# Altium schematic sheet Sheet2.SchDoc: SMART METER Main Board
size A3; SheetNumber: 2
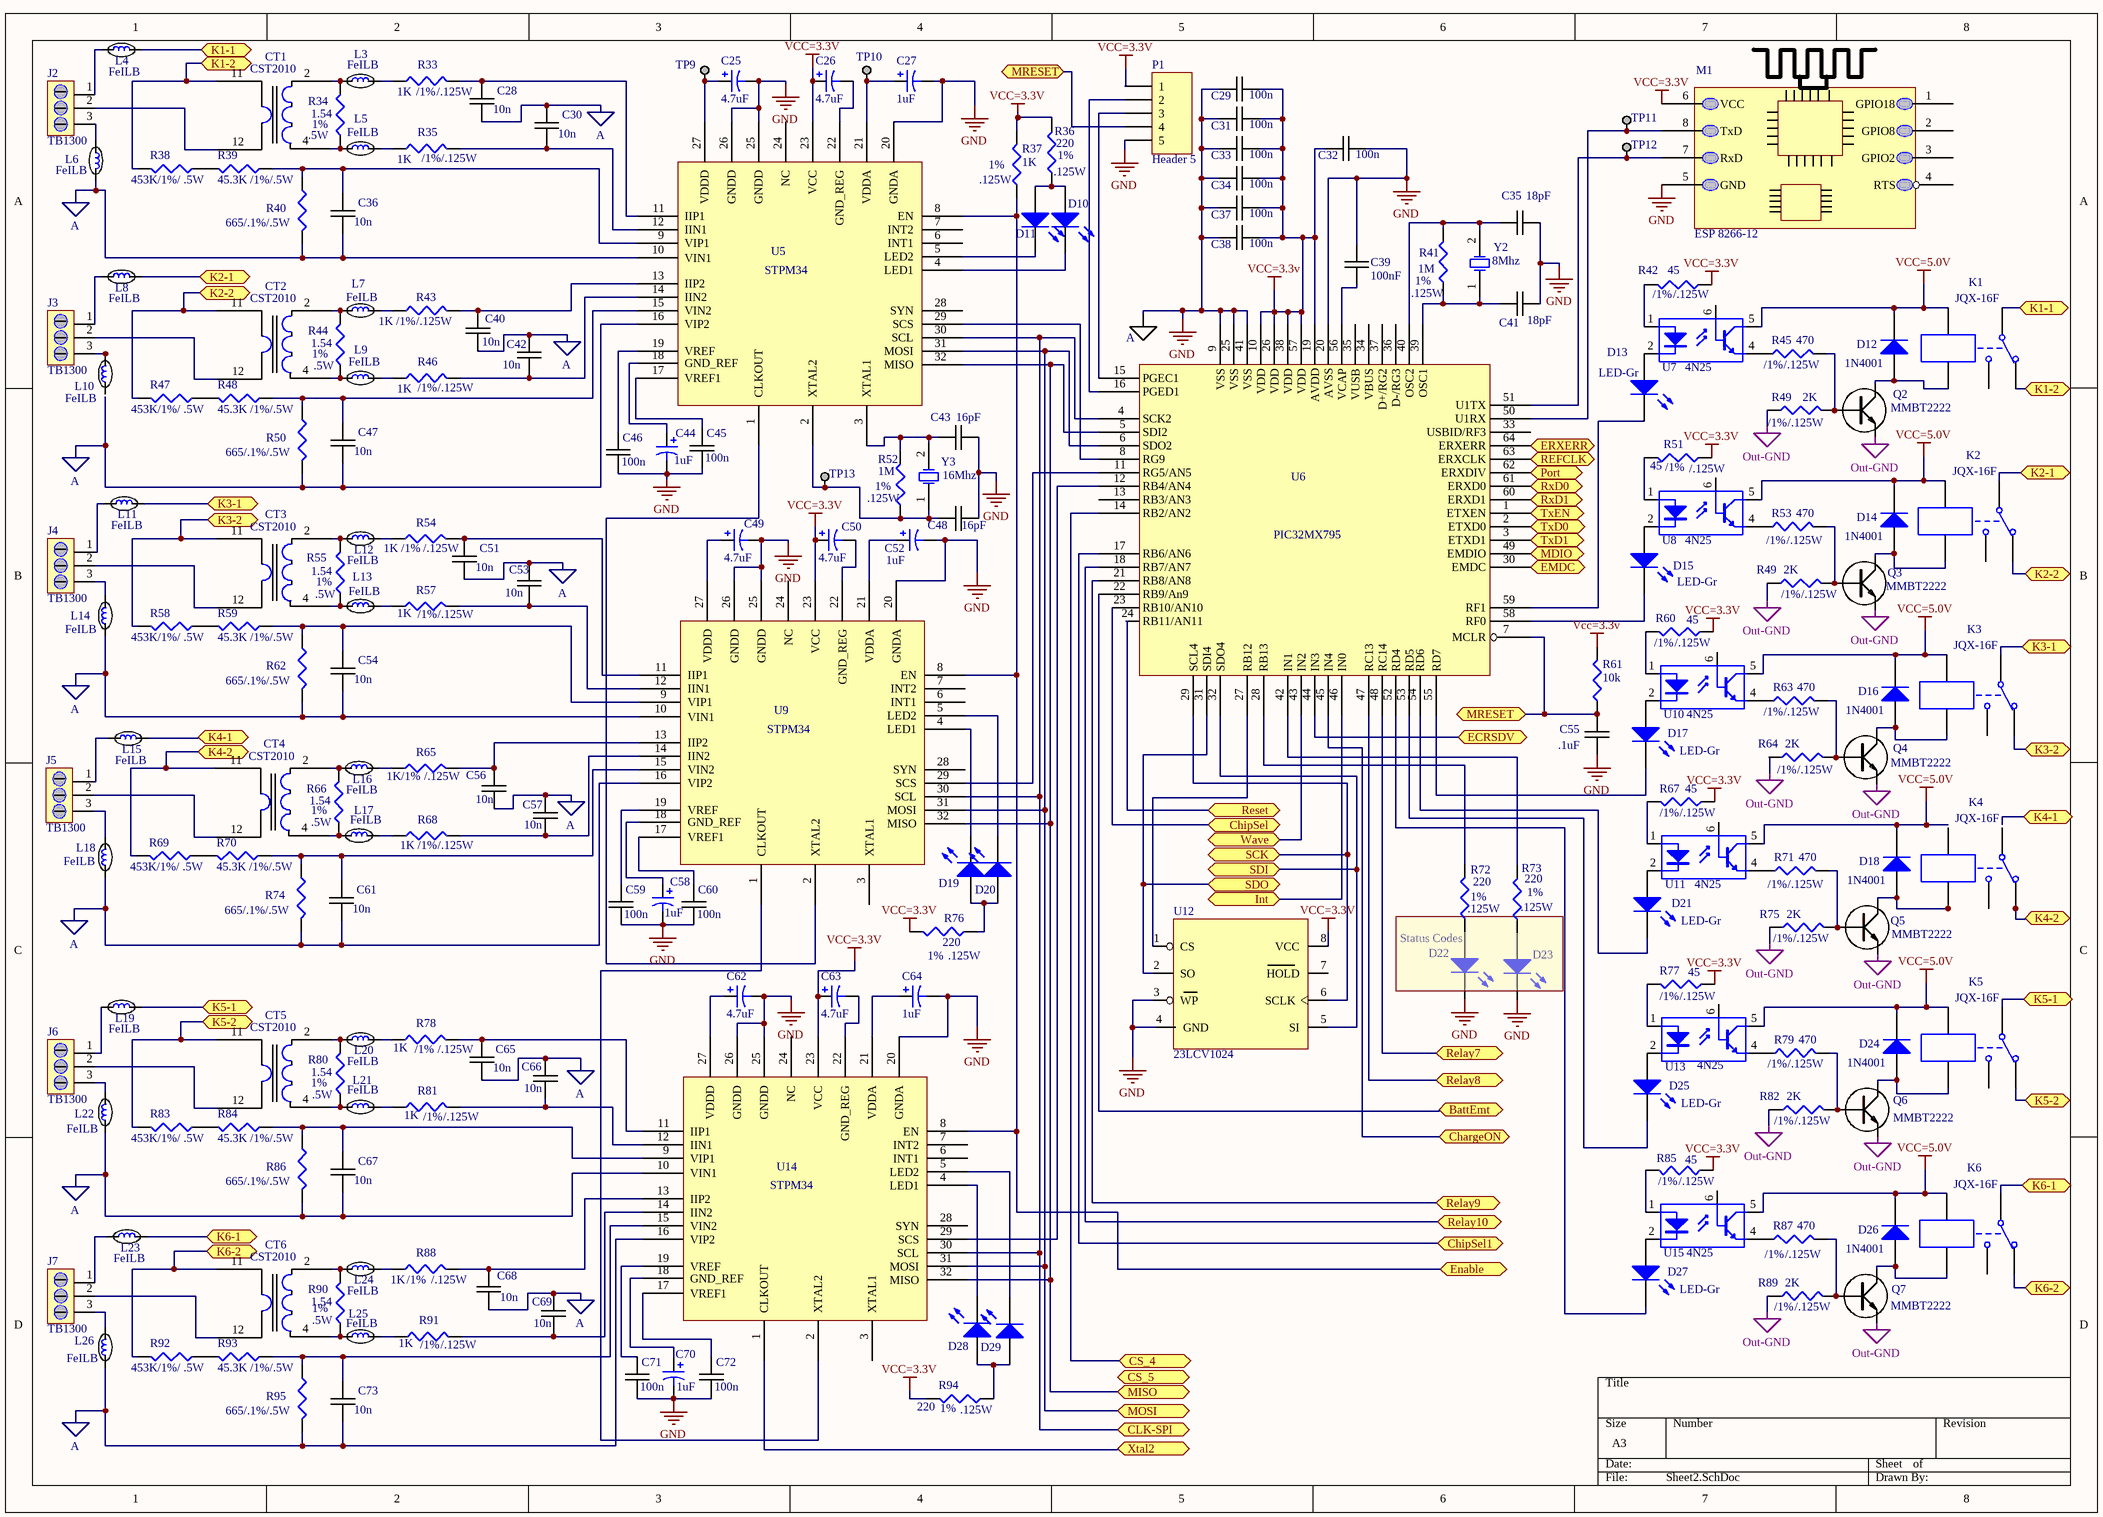
[diagram p0: Sheet2.SchDoc]

## Parts
(Parts that share a designator on the sheet are numbered #1, #2 ... from top to bottom, then left to right.)
1  AGND  [HC49/4H_SMX]  (value not drawn)
C25  4.7uF  [C0805]
C26  4.7uF  [C0805]
C27  1uF  [C0805]
C28  10n  [0805C-TBD]
C29  100n  [0805C-TBD]
C30  10n  [0805C-TBD]
C31  100n  [0805C-TBD]
C32  100n  [0805C-TBD]
C33  100n  [0805C-TBD]
C34  100n  [0805C-TBD]
C35  18pF  [0805C-TBD]
C36  10n  [0805C-TBD]
C37  100n  [0805C-TBD]
C38  100n  [0805C-TBD]
C39  100nF  [0805C-TBD]
C40  10n  [0805C-TBD]
C41  18pF  [0805C-TBD]
C42  10n  [0805C-TBD]
C43  16pF  [0805C-TBD]
C44  1uF  [C0805]
C45  100n  [0805C-TBD]
C46  100n  [0805C-TBD]
C47  10n  [0805C-TBD]
C48  16pF  [0805C-TBD]
C49  4.7uF  [C0805]
C50  4.7uF  [C0805]
C51  10n  [0805C-TBD]
C52  1uF  [C0805]
C53  10n  [0805C-TBD]
C54  10n  [0805C-TBD]
C55  .1uF  [0805C-TBD]
C56  10n  [0805C-TBD]
C57  10n  [0805C-TBD]
C58  1uF  [C0805]
C59  100n  [0805C-TBD]
C60  100n  [0805C-TBD]
C61  10n  [0805C-TBD]
C62  4.7uF  [C0805]
C63  4.7uF  [C0805]
C64  1uF  [C0805]
C65  10n  [0805C-TBD]
C66  10n  [0805C-TBD]
C67  10n  [0805C-TBD]
C68  10n  [0805C-TBD]
C69  10n  [0805C-TBD]
C70  1uF  [C0805]
C71  100n  [0805C-TBD]
C72  100n  [0805C-TBD]
C73  10n  [0805C-TBD]
CT1  CST2010  [CST2010]
CT2  CST2010  [CST2010]
CT3  CST2010  [CST2010]
CT4  CST2010  [CST2010]
CT5  CST2010  [CST2010]
CT6  CST2010  [CST2010]
D10  LED2  [3.2X1.6X1.1]  (value not drawn)
D11  LED2  [3.2X1.6X1.1]  (value not drawn)
D12  1N4001  [DO-214AC]
D13  LED-Gr  [3.2X1.6X1.1]
D14  1N4001  [DO-214AC]
D15  LED-Gr  [3.2X1.6X1.1]
D16  1N4001  [DO-214AC]
D17  LED-Gr  [3.2X1.6X1.1]
D18  1N4001  [DO-214AC]
D19  LED2  [3.2X1.6X1.1]  (value not drawn)
D20  LED2  [3.2X1.6X1.1]  (value not drawn)
D21  LED-Gr  [3.2X1.6X1.1]
D22  LED2  [3.2X1.6X1.1]  (value not drawn)
D23  LED2  [3.2X1.6X1.1]  (value not drawn)
D24  1N4001  [DO-214AC]
D25  LED-Gr  [3.2X1.6X1.1]
D26  1N4001  [DO-214AC]
D27  LED-Gr  [3.2X1.6X1.1]
D28  LED2  [3.2X1.6X1.1]  (value not drawn)
D29  LED2  [3.2X1.6X1.1]  (value not drawn)
J2  TB1300  [TB-1300-0-C]
J3  TB1300  [TB-1300-0-C]
J4  TB1300  [TB-1300-0-C]
J5  TB1300  [TB-1300-0-C]
J6  TB1300  [TB-1300-0-C]
J7  TB1300  [TB-1300-0-C]
K1  JQX-16F  [JQX-16f]
K2  JQX-16F  [JQX-16f]
K3  JQX-16F  [JQX-16f]
K4  JQX-16F  [JQX-16f]
K5  JQX-16F  [JQX-16f]
K6  JQX-16F  [JQX-16f]
L3  FeILB
L4  FeILB
L5  FeILB
L6  FeILB
L7  FeILB
L8  FeILB
L9  FeILB
L10  FeILB
L11  FeILB
L12  FeILB
L13  FeILB
L14  FeILB
L15  FeILB
L16  FeILB
L17  FeILB
L18  FeILB
L19  FeILB
L20  FeILB
L21  FeILB
L22  FeILB
L23  FeILB
L24  FeILB
L25  FeILB
L26  FeILB
M1  ESP 8266-12  [ESP_1]
P1  Header 5  [HDR1X5]
Q2  MMBT2222  [SOT23-BCE]
Q3  MMBT2222  [SOT23-BCE]
Q4  MMBT2222  [SOT23-BCE]
Q5  MMBT2222  [SOT23-BCE]
Q6  MMBT2222  [SOT23-BCE]
Q7  MMBT2222  [SOT23-BCE]
R33  1K  [0805R-10]
R34  1.54  [0805R-10]
R35  1K  [0805R-10]
R36  220  [J1-0603]
R37  1K  [J1-0603]
R38  453K/1%/ .5W  [1210R-GENERIC]
R39  45.3K /1%/.5W  [1210C-GENERIC]
R40  665/.1%/.5W  [1210C-GENERIC]
R41  1M  [J1-0603]
R42  45  [0805R-68]
R43  1K  [0805R-10]
R44  1.54  [0805R-10]
R45  470  [0805R-39]
R46  1K  [0805R-10]
R47  453K/1%/ .5W  [1210R-GENERIC]
R48  45.3K /1%/.5W  [1210C-GENERIC]
R49#1  2K  [0805R-180]
R49#2  2K  [0805R-180]
R50  665/.1%/.5W  [1210C-GENERIC]
R51  45  [0805R-68]
R52  1M  [J1-0603]
R53  470  [0805R-39]
R54  1K  [0805R-10]
R55  1.54  [0805R-10]
R57  1K  [0805R-10]
R58  453K/1%/ .5W  [1210R-GENERIC]
R59  45.3K /1%/.5W  [1210C-GENERIC]
R60  45  [0805R-68]
R61  10k  [J1-0603]
R62  665/.1%/.5W  [1210C-GENERIC]
R63  470  [0805R-39]
R64  2K  [0805R-180]
R65  1K  [0805R-10]
R66  1.54  [0805R-10]
R67  45  [0805R-68]
R68  1K  [0805R-10]
R69  453K/1%/ .5W  [1210R-GENERIC]
R70  45.3K /1%/.5W  [1210C-GENERIC]
R71  470  [0805R-39]
R72  220  [J1-0603]
R73  220  [J1-0603]
R74  665/.1%/.5W  [1210C-GENERIC]
R75  2K  [0805R-180]
R76  220  [J1-0603]
R77  45  [0805R-68]
R78  1K  [0805R-10]
R79  470  [0805R-39]
R80  1.54  [0805R-10]
R81  1K  [0805R-10]
R82  2K  [0805R-180]
R83  453K/1%/ .5W  [1210R-GENERIC]
R84  45.3K /1%/.5W  [1210C-GENERIC]
R85  45  [0805R-68]
R86  665/.1%/.5W  [1210C-GENERIC]
R87  470  [0805R-39]
R88  1K  [0805R-10]
R89  2K  [0805R-180]
R90  1.54  [0805R-10]
R91  1K  [0805R-10]
R92  453K/1%/ .5W  [1210R-GENERIC]
R93  45.3K /1%/.5W  [1210C-GENERIC]
R94  220  [J1-0603]
R95  665/.1%/.5W  [1210C-GENERIC]
TP9  TESTPOINT  [TESTPOINT]  (value not drawn)
TP10  TESTPOINT  [TESTPOINT]  (value not drawn)
TP11  TESTPOINT  [TESTPOINT]  (value not drawn)
TP12  TESTPOINT  [TESTPOINT]  (value not drawn)
TP13  TESTPOINT  [TESTPOINT]  (value not drawn)
U5  STPM34  [QFN32_M]
U6  PIC32MX795  [QFN64_N]
U7  4N25  [4N25]
U8  4N25  [4N25]
U9  STPM34  [QFN32_M]
U10  4N25  [4N25]
U11  4N25  [4N25]
U12  23LCV1024
U13  4N25  [4N25]
U14  STPM34  [QFN32_M]
U15  4N25  [4N25]
Y2  8Mhz  [R38]
Y3  16Mhz  [R38]

## Ports
BattEmt, ChargeON, ChipSel, ChipSel1, CLK-SPI, CS_4, CS_5, ECRSDV, EMDC, Enable, ERXERR, Int, K1-1, K1-2, K2-1, K2-2, K3-1, K3-2, K4-1, K4-2, K5-1, K5-2, K6-1, K6-2, MDIO, MISO, MOSI, MRESET, Port, REFCLK, Relay7, Relay8, Relay9, Relay10, Reset, RxD0, RxD1, SCK, SDI, SDO, TxD0, TxD1, TxEN, Wave, Xtal2

## Nets
A: C28.1 C30.2 C36.1 C40.1 C42.2 C47.1 C51.1 C53.2 C54.1 C56.1 C57.2 C61.1 C65.1 C66.2 C67.1 C68.1 C69.2 C73.1 L6.2 L14.1 L18.1 L22.1 L26.1 R40.2 R50.2 R62.2 R74.2 R86.2 R95.2 U5.10(VIN1) U5.16(VIP2) U9.10(VIN1) U9.16(VIP2) U14.10(VIN1) U14.16(VIP2)
GND: 1.VIN18 C25.2 C27.2 C29.2 C31.2 C32.1 C33.2 C34.2 C35.2 C37.2 C38.2 C39.2 C41.2 C43.2 C44.2 C45.1 C46.1 C48.2 C49.2 C52.2 C55.1 C58.2 C59.1 C60.1 C62.2 C64.2 C70.2 C71.1 C72.1 D22.2(K) D23.2(K) M1.5(GND) P1.5 U5.20(GNDA) U5.25(GNDD) U5.26(GNDD) U6.9(VSS) U6.20(AVSS) U6.25(VSS) U6.41(VSS) U9.20(GNDA) U9.25(GNDD) U9.26(GNDD) U12.3(WP) U12.4(GND) U14.20(GNDA) U14.25(GNDD) U14.26(GNDD)
Out-GND: Q2.E Q3.E Q4.E Q5.E Q6.E Q7.E R49#1.1 R49#2.1 R64.1 R75.1 R82.1 R89.1
VCC=3.3V: C26.1 C29.1 C31.1 C32.2 C33.1 C34.1 C37.1 C38.1 C50.1 C63.1 M1.6(VCC) P1.1 R36.2 R37.2 R42.1 R51.1 R60.1 R61.2 R67.1 R76.2 R77.1 R85.1 R94.2 U5.23(VCC) U6.10(VDD) U6.19(AVDD) U6.26(VDD) U6.38(VDD) U6.57(VDD) U9.23(VCC) U12.8(VCC) U14.23(VCC)
VCC=5.0V: D12.2(K) D14.2(K) D16.2(K) D18.2(K) D24.2(K) D26.2(K) K1.4 K2.4 K3.4 K5.4 K6.4 U7.5(C) U8.5(C) U10.5(C) U11.5(C) U13.5(C) U15.5(C)
BattEmt: U6.22(RB9/An9) ; port BattEmt
ChargeON: U6.45(IN4) ; port ChargeON
ChipSel: U6.23(RB10/AN10) ; port ChipSel
ChipSel1: U6.17(RB6/AN6) ; port ChipSel1
CLK-SPI: U5.30(SCL) U6.4(SCK2) U9.30(SCL) U14.30(SCL) ; port CLK-SPI
CS_4: U6.14(RB2/AN2) ; port CS_4
ECRSDV: U6.44(IN3) ; port ECRSDV
EMDC: U6.30(EMDC) ; port EMDC
Enable: R37.1 U5.8(EN) U9.8(EN) U14.8(EN) ; port Enable
ERXERR: U6.64(ERXERR) ; port ERXERR
Int: U6.46(IN0) ; port Int
K1-1: K1.1 L4.2 ; port K1-1
K1-2: CT1.11 K1.2 R38.2 ; port K1-2
K2-1: K2.1 L8.2 ; port K2-1
K2-2: CT2.11 K2.2 R47.2 ; port K2-2
K3-1: K3.1 L11.2 ; port K3-1
K3-2: CT3.11 K3.2 R58.2 ; port K3-2
K4-1: L15.2 ; port K4-1
K4-2: CT4.11 K4.2 R69.2 ; port K4-2
K5-1: K5.1 L19.2 ; port K5-1
K5-2: CT5.11 K5.2 R83.2 ; port K5-2
K6-1: K6.1 L23.2 ; port K6-1
K6-2: CT6.11 K6.2 R92.2 ; port K6-2
MDIO: U6.49(EMDIO) ; port MDIO
MISO: U5.32(MISO) U6.5(SDI2) U9.32(MISO) U14.32(MISO) ; port MISO
MOSI: U5.31(MOSI) U6.6(SDO2) U9.31(MOSI) U14.31(MOSI) ; port MOSI
MRESET: C55.2 P1.4 R61.1 U6.7(MCLR) ; port MRESET
Port: U6.62(ERXDIV) ; port Port
REFCLK: U6.63(ERXCLK) ; port REFCLK
Relay7: U6.48(RC14) ; port Relay7
Relay8: U6.47(RC13) ; port Relay8
Relay9: U6.21(RB8/AN8) ; port Relay9
Relay10: U6.18(RB7/AN7) ; port Relay10
Reset: U6.24(RB11/AN11) ; port Reset
RxD0: U6.61(ERXD0) ; port RxD0
RxD1: U6.60(ERXD1) ; port RxD1
SCK: U6.29(SCL4) U12.6(SCLK) ; port SCK
SDI: U6.32(SDO4) U12.5(SI) ; port SDI
SDO: U6.31(SDI4) U12.2(SO) ; port SDO
TxD0: U6.2(ETXD0) ; port TxD0
TxD1: U6.3(ETXD1) ; port TxD1
TxEN: U6.1(ETXEN) ; port TxEN
Wave: U6.43(IN2) ; port Wave
Xtal2: U14.1(CLKOUT) ; port Xtal2
NetC25_1: C25.1 TP9.1 U5.27(VDDD)
NetC26_2: C26.2 U5.22(GND_REG)
NetC27_1: C27.1 TP10.1 U5.21(VDDA)
NetC28_2: C28.2 R33.2 U5.11(IIP1)
NetC30_1: C30.1 R35.2 U5.12(IIN1)
NetC35_1: C35.1 R41.2 U6.40(OSC2) Y2.2(OSC2)
NetC36_2: C36.2 R39.1 R40.1 U5.9(VIP1)
NetC39_1: C39.1 U6.56(VCAP)
NetC40_2: C40.2 R43.2 U5.13(IIP2)
NetC41_1: C41.1 R41.1 U6.39(OSC1) Y2.1(OSC1)
NetC42_1: C42.1 R46.2 U5.14(IIN2)
NetC43_1: C43.1 R52.2 U5.3(XTAL1) Y3.2(OSC2)
NetC44_1: C44.1 U5.18(GND_REF)
NetC45_2: C45.2 U5.17(VREF1)
NetC46_2: C46.2 U5.19(VREF)
NetC47_2: C47.2 R48.1 R50.1 U5.15(VIN2)
NetC48_1: C48.1 R52.1 TP13.1 U5.2(XTAL2) Y3.1(OSC1)
NetC49_1: C49.1 U9.27(VDDD)
NetC50_2: C50.2 U9.22(GND_REG)
NetC51_2: C51.2 R54.2 U9.11(IIP1)
NetC52_1: C52.1 U9.21(VDDA)
NetC53_1: C53.1 R57.2 U9.12(IIN1)
NetC54_2: C54.2 R59.1 R62.1 U9.9(VIP1)
NetC56_2: C56.2 R65.2 U9.13(IIP2)
NetC57_1: C57.1 R68.2 U9.14(IIN2)
NetC58_1: C58.1 U9.18(GND_REF)
NetC59_2: C59.2 U9.19(VREF)
NetC60_2: C60.2 U9.17(VREF1)
NetC61_2: C61.2 R70.1 R74.1 U9.15(VIN2)
NetC62_1: C62.1 U14.27(VDDD)
NetC63_2: C63.2 U14.22(GND_REG)
NetC64_1: C64.1 U14.21(VDDA)
NetC65_2: C65.2 R78.2 U14.11(IIP1)
NetC66_1: C66.1 R81.2 U14.12(IIN1)
NetC67_2: C67.2 R84.1 R86.1 U14.9(VIP1)
NetC68_2: C68.2 R88.2 U14.13(IIP2)
NetC69_1: C69.1 R91.2 U14.14(IIN2)
NetC70_1: C70.1 U14.18(GND_REF)
NetC71_2: C71.2 U14.19(VREF)
NetC72_2: C72.2 U14.17(VREF1)
NetC73_2: C73.2 R93.1 R95.1 U14.15(VIN2)
NetCT1_2: CT1.2 L3.1 R34.2
NetCT1_4: CT1.4 L5.1 R34.1
NetCT1_12: CT1.12 J2.2
NetCT2_2: CT2.2 L7.1 R44.2
NetCT2_4: CT2.4 L9.1 R44.1
NetCT2_12: CT2.12 J3.2
NetCT3_2: CT3.2 L12.1 R55.2
NetCT3_4: CT3.4 L13.1 R55.1
NetCT3_12: CT3.12 J4.2
NetCT4_2: CT4.2 L16.1 R66.2
NetCT4_4: CT4.4 L17.1 R66.1
NetCT4_12: CT4.12 J5.2
NetCT5_2: CT5.2 L20.1 R80.2
NetCT5_4: CT5.4 L21.1 R80.1
NetCT5_12: CT5.12 J6.2
NetCT6_2: CT6.2 L24.1 R90.2
NetCT6_4: CT6.4 L25.1 R90.1
NetCT6_12: CT6.12 J7.2
NetD10_1: D10.1(A) D11.1(A) R36.1
NetD10_2: D10.2(K) U5.4(LED1)
NetD11_2: D11.2(K) U5.5(LED2)
NetD12_1: D12.1(A) K1.5 Q2.C
NetD13_1: D13.1(A) U7.2(K)
NetD13_2: D13.2(K) U6.59(RF1)
NetD14_1: D14.1(A) K2.5 Q3.C
NetD15_1: D15.1(A) U8.2(K)
NetD15_2: D15.2(K) U6.58(RF0)
NetD16_1: D16.1(A) K3.5 Q4.C
NetD17_1: D17.1(A) U10.2(K)
NetD17_2: D17.2(K) U6.55(RD7)
NetD18_1: D18.1(A) K4.5 Q5.C
NetD19_1: D19.1(A) D20.1(A) R76.1
NetD19_2: D19.2(K) U9.4(LED1)
NetD20_2: D20.2(K) U9.5(LED2)
NetD21_1: D21.1(A) U11.2(K)
NetD21_2: D21.2(K) U6.54(RD6)
NetD22_1: D22.1(A) R72.1
NetD23_1: D23.1(A) R73.1
NetD24_1: D24.1(A) K5.5 Q6.C
NetD25_1: D25.1(A) U13.2(K)
NetD25_2: D25.2(K) U6.53(RD5)
NetD26_1: D26.1(A) K6.5 Q7.C
NetD27_1: D27.1(A) U15.2(K)
NetD27_2: D27.2(K) U6.52(RD4)
NetD28_1: D28.1(A) D29.1(A) R94.1
NetD28_2: D28.2(K) U14.4(LED1)
NetD29_2: D29.2(K) U14.5(LED2)
NetJ2_1: J2.1 L4.1
NetJ2_3: J2.3 L6.1
NetJ3_1: J3.1 L8.1
NetJ3_3: J3.3 L10.2
NetJ4_1: J4.1 L11.1
NetJ4_3: J4.3 L14.2
NetJ5_1: J5.1 L15.1
NetJ5_3: J5.3 L18.2
NetJ6_1: J6.1 L19.1
NetJ6_3: J6.3 L22.2
NetJ7_1: J7.1 L23.1
NetJ7_3: J7.3 L26.2
NetL3_2: L3.2 R33.1
NetL5_2: L5.2 R35.1
NetL7_2: L7.2 R43.1
NetL9_2: L9.2 R46.1
NetL12_2: L12.2 R54.1
NetL13_2: L13.2 R57.1
NetL16_2: L16.2 R65.1
NetL17_2: L17.2 R68.1
NetL20_2: L20.2 R78.1
NetL21_2: L21.2 R81.1
NetL24_2: L24.2 R88.1
NetL25_2: L25.2 R91.1
NetM1_7: M1.7(RxD) TP12.1 U6.51(U1TX)
NetM1_8: M1.8(TxD) TP11.1 U6.50(U1RX)
NetP1_2: P1.2 U6.16(PGED1)
NetP1_3: P1.3 U6.15(PGEC1)
NetQ2_B: Q2.B R45.2 R49#1.2
NetQ3_B: Q3.B R49#2.2 R53.2
NetQ4_B: Q4.B R63.2 R64.2
NetQ5_B: Q5.B R71.2 R75.2
NetQ6_B: Q6.B R79.2 R82.2
NetQ7_B: Q7.B R87.2 R89.2
NetR38_1: R38.1 R39.2
NetR42_2: R42.2 U7.1(A)
NetR45_1: R45.1 U7.4(E)
NetR47_1: R47.1 R48.2
NetR51_2: R51.2 U8.1(A)
NetR53_1: R53.1 U8.4(E)
NetR58_1: R58.1 R59.2
NetR60_2: R60.2 U10.1(A)
NetR63_1: R63.1 U10.4(E)
NetR67_2: R67.2 U11.1(A)
NetR69_1: R69.1 R70.2
NetR71_1: R71.1 U11.4(E)
NetR72_2: R72.2 U6.28(RB13)
NetR73_2: R73.2 U6.42(IN1)
NetR77_2: R77.2 U13.1(A)
NetR79_1: R79.1 U13.4(E)
NetR83_1: R83.1 R84.2
NetR85_2: R85.2 U15.1(A)
NetR87_1: R87.1 U15.4(E)
NetR92_1: R92.1 R93.2
NetU5_1: U5.1(CLKOUT) U9.2(XTAL2)
NetU5_29: U5.29(SCS) U6.8(RG9)
NetU6_11: U6.11(RG5/AN5) U9.29(SCS)
NetU6_12: U6.12(RB4/AN4) U14.29(SCS)
NetU6_27: U6.27(RB12) U12.1(CS)
NetU9_1: U9.1(CLKOUT) U14.2(XTAL2)

Not connected (* = marked no-connect by the designer): K1 3; K2 3; K3 3; K4 1 3 4; K5 3; K6 3; L10 1; M1 1(GPIO18) 2(GPIO8) 3(GPIO2) 4(RTS); U5 6(INT1) 7(INT2) 24(NC) 28(SYN); U6 13(RB3/AN3) 33(USBID/RF3) 34(VBUS) 35(VUSB) 36(D-/RG3) 37(D+/RG2); U7 6(B); U8 6(B); U9 3(XTAL1) 6(INT1) 7(INT2) 24(NC) 28(SYN); U10 6(B); U11 6(B); U12 7(HOLD); U13 6(B); U14 3(XTAL1) 6(INT1) 7(INT2) 24(NC) 28(SYN); U15 6(B)

## Notes on the sheet
- (near R33) /1%
- /.125W
- .5W
- 1%
- (near R35) /1%/.125W
- (near R37) .125W
- (near R37) 1%
- (near R36) .125W
- (near R36) 1%
- (near R43) /1%
- (near R43) /.125W
- (near R41) .125W
- (near R41) 1%
- (near R42) /1%
- (near R42) /.125W
- (near R46) /1%
- (near R46) /.125W
- (near R45) /1%
- (near R45) /.125W
- (near R49#1) /1%
- (near R49#1) /.125W
- (near R52) .125W
- (near R52) 1%
- (near R51) /1%
- (near R51) /.125W
- (near R55) 1%
- (near R54) /1%
- (near R53) /1%
- (near R53) /.125W
- (near R57) /1%
- (near R57) /.125W
- (near R60) /1%
- (near R60) /.125W
- (near R49#2) /1%
- (near R63) /1%
- (near R63) /.125W
- (near R65) /1%
- (near R65) /.125W
- (near R64) /1%
- (near R64) /.125W
- (near R68) /1%
- (near R68) /.125W
- (near R67) /1%
- (near R67) /.125W
- (near R72) .125W
- (near R72) 1%
- (near R73) .125W
- (near R73) 1%
- (near R71) /1%
- (near R71) /.125W
- (near R76) 1%
- (near R76) .125W
- Status Codes
- /1%
- (near R75) /1%
- (near R75) /.125W
- (near R78) /1%
- (near R79) /1%
- (near R79) /.125W
- (near R81) /1%
- (near R81) /.125W
- (near R82) /1%
- (near R82) /.125W
- (near R85) /1%
- (near R85) /.125W
- (near R87) /1%
- (near R87) /.125W
- (near R88) /1%
- (near R88) /.125W
- (near R89) /1%
- (near R89) /.125W
- (near R91) /1%
- (near R91) /.125W
- (near R94) 1%
- (near R94) .125W
- (in symbol AGND) A

## Library data of the parts
C25 C26 C49 C50 C62 C63 = Cap Pol3: Polarized Capacitor (Surface Mount); Manufacturer: Kemet; Mfr.PN#: T491A106K006AT7280; Value: 100pF; Suppl.PN#: 399-10116-ND; Published: 8-Jun-2000; LatestRevisionDate: 29-May-2009; LatestRevisionNote: IPC-7351 Footprint Added.; PackageReference: C0805; Publisher: Altium Limited; PackageDescription: Chip Capacitor; Supplier: Digi-Key; SMD: 1206; Price: .065
C27 C44 C52 C58 C64 C70 = Cap Pol3: Polarized Capacitor (Surface Mount); Manufacturing: Vishay  Spraque; Mfr.PN#: 298D105X06R3k2T; Value: 100pF; Suppl.PN#: 298D105X06R3k2T-ND; Published: 8-Jun-2000; LatestRevisionDate: 29-May-2009; LatestRevisionNote: IPC-7351 Footprint Added.; PackageReference: C0805; Publisher: Altium Limited; PackageDescription: Chip Capacitor; Supplier: Digi-Key; SMD: 0402; Price: .4
C28 C30 C36 C40 C42 C47 C51 C53 C54 C56 C57 C61 C65-C69 C73 = 0805C-18PF-50V-C0G-JOH: CAPACITOR 0805 CERAMIC; Manufacturer: Murata Electronics; Mfr.PN#: CRM155R71H103KA880; Suppl.PN#: 490-4516-2-ND; Supplier 1: Digi-Key; Supplier Part Number 1: 709-1171-2-ND; Value: 10n; mfr PN: *; Package reference: 0805-TBD; Supplier: Digi-Key; smd: 0402; Price: .002
C29 C31-C34 C37 C38 C45 C46 C59 C60 C71 C72 = 0805C-18PF-50V-C0G-JOH: CAPACITOR 0805 CERAMIC; Manufacturer: Murata Electronnics; Mfr.PN#: GRM155R61A104KA01; Value: 10n; Suppl.PN#: 490-1318-2-ND; Pprice: 0.0021; Supplier 1: Digi-Key; Supplier Part Number 1: 709-1171-2-ND; mfr PN: *; Package reference: 0805-TBD; Supplier: Digi-Key; SMD: 0402
C35 C39 C41 = 0805C-18PF-50V-C0G-JOH: CAPACITOR 0805 CERAMIC; Supplier 1: Digi-Key; Supplier Part Number 1: 709-1171-2-ND
C43 C48 = 0805C-18PF-50V-C0G-JOH: CAPACITOR 0805 CERAMIC; Manufacturer: Kemet; Mfr.PN#: C0402C160J4GACTU; Suppl.PN#: 399-8947-2-ND; Supplier 1: Digi-Key; Supplier Part Number 1: 709-1171-2-ND; Supplier: Digi-Key; Price: .00987; SMD: 0402
C55 = 0805C-18PF-50V-C0G-JOH: CAPACITOR 0805 CERAMIC; Manufacturer: Samsung; Mfr.PN#: CL05B104KO5NNC; Suppl.PN#: 1276-1001-2-ND; Supplier 1: Digi-Key; Supplier Part Number 1: 709-1171-2-ND; Supplier: Digi-Key; Price: .00206; SMD: 0402
CT1-CT6 = CurrentTransf: Manufacturer: Coilcraft; Mfr.PN#: CST2010-200L; Price: 1.14
D10 D11 D19 D20 D22 D23 = LED2: Typical RED, GREEN, YELLOW, AMBER GaAs LED; Published: 8-Jun-2000; LatestRevisionDate: 17-Jul-2002; LatestRevisionNote: Re-released for DXP Platform.; PackageVersion: Feb-2002; PackageReference: 3.2X1.6X1.1; Publisher: Altium Limited; PackageDescription: SM LED; 2 Flat Leads
D12 D14 D16 D18 D24 D26 = Diode 1N4001: 1 Amp General Purpose Rectifier; Manufacturer: Diode Incorporated; Mfr.PN#: S1AB-13; Suppl.PN#: S1ABD1TR-ND; Published: 8-Jun-2000; LatestRevisionDate: 17-Jul-2002; LatestRevisionNote: Re-released for DXP Platform.; DatasheetVersion: 1998; PackageVersion: Aug-1999; PackageReference: DO-41; Publisher: Altium Limited; PackageDescription: Diode, Axial; Body 5.2 x 2.7 mm (LxDia. max), Lead Dia. 0.86 mm (max); Code_JEDEC: DO-204-AL; ComponentLink1Description: Manufacturer Link; ComponentLink1URL: http://www.fairchildsemi.com/; ComponentLink2Description: Datasheet; ComponentLink2URL: http://www.fairchildsemi.com/ds/1N%2F1N4001.pdf; Supplier: Digi-Key; Price: .1
D13 D15 D17 D21 D25 D27 = LED2: Typical RED, GREEN, YELLOW, AMBER GaAs LED; Manufacturer: Lite-On Inc; Mfr.PN#: LTST-C191KGKT; Suppl.PN#: 160-1446-2-ND; Published: 8-Jun-2000; LatestRevisionDate: 17-Jul-2002; LatestRevisionNote: Re-released for DXP Platform.; PackageVersion: Feb-2002; PackageReference: 3.2X1.6X1.1; Publisher: Altium Limited; PackageDescription: SM LED; 2 Flat Leads; Supplier: Digi-Key; Price: .04
D28 D29 = LED2: Typical RED, GREEN, YELLOW, AMBER GaAs LED; Manufacturer: Lite-On Inc; Mfr.PN#: LTST-C191KRKT; Suppl.PN#: 160-1447-2-ND; Published: 8-Jun-2000; LatestRevisionDate: 17-Jul-2002; LatestRevisionNote: Re-released for DXP Platform.; PackageVersion: Feb-2002; PackageReference: 3.2X1.6X1.1; Publisher: Altium Limited; PackageDescription: SM LED; 2 Flat Leads; Price: .04; Supplier: Digi-Key
J2-J7 = TermBlock-2: Manufacturer: SCED Electronics Co.Ltd China; Mfr.PN#: TB1300-00-C; Price: .3
K1-K6 = Relay-SPDT: Single-Pole Dual-Throw Relay; Manufacturer: YUEQING HENGWEI Electronics CO,Ltd; Mfr.PN#: JQX-16F(T91)30A1CDC5; Published: 24-Mar-1999; LatestRevisionDate: 17-Jul-2002; LatestRevisionNote: Re-released for DXP Platform.; PackageReference: MODULE5B; Publisher: Altium Limited; Supplier: Shanghai Shinvo Electric Co.Ltd; Price: .2
L3-L26 = FerrBeads/ILBB: Manufacturer: Brand Samsung; Mfr.PN#: C1M10J152NC; Suppl.PN#: 1276-6326-1-ND; Supplier: Digi-Key; Price: .027
M1 = ESP 8266
P1 = Header 5: Header, 5-Pin; LatestRevisionDate: 17-Jul-2002; LatestRevisionNote: Re-released for DXP Platform.; Publisher: Altium Limited
Q2-Q7 = MMBT2222: BC847 SMALL SIGNAL NPN TRANSISTOR; Manufacturer: Diodes  Inc.; Mfr.PN#: MMBT2222A-7-F; Suppl.PN#: MMBT2222A-FDICT-ND; Supplier 1: Digi-Key; Supplier Part Number 1: MMBT2222A-FDICT-ND; Supplier: Digi-Key; Package: SOT-323; Price: .03
R33 R35 R43 R46 R54 R57 R65 R68 R78 R81 R88 R91 = Res3: Resistor; Manufacturer: Stackpole Electronics; Mfr.PN#: RNCP1206FTD1K00; Value: 1K 1%; Suppl.PN#: RNCP1206FTD1K00TR-ND; Published: 8-Jun-2000; LatestRevisionDate: 29-May-2009; LatestRevisionNote: IPC-7351 Footprint Added.; PackageReference: J1-0603; Publisher: Altium Limited; PackageDescription: Chip Resistor; Supplier: Digi-Key; Price: .05
R34 R44 R55 R66 R80 R90 = Res3: Resistor; Manufacturer: Vishay Pale; Mfr.PN#: CR0W12061R54FKEAHP; Value: 1K 1%; Suppl.PN#: 541-1.54UTR-ND; Published: 8-Jun-2000; LatestRevisionDate: 29-May-2009; LatestRevisionNote: IPC-7351 Footprint Added.; PackageReference: J1-0603; Publisher: Altium Limited; PackageDescription: Chip Resistor; Supplier: Digi-Key; Price: .05; SMD: 1206
R36 R72 R73 R76 R94 = Res3: Resistor; Manufacturer: Stackpole Electronics; Mfr.PN#: RMCF0805FT220R; Value: 1K 1%; Suppl.PN#: RMCF0805FT220RTR-ND; Published: 8-Jun-2000; LatestRevisionDate: 29-May-2009; LatestRevisionNote: IPC-7351 Footprint Added.; PackageReference: J1-0603; Publisher: Altium Limited; PackageDescription: Chip Resistor; manufacture P/N: *; Supplier: Digi-Key; Price: .0027
R37 = Res3: Resistor; Manufacturer: Stackpole; Mfr.PN#: RMCF0805FT1K00; Value: 1K/.125W/1%; Suppl.PN#: RMCF0805FT1K00TR-ND; Published: 8-Jun-2000; LatestRevisionDate: 29-May-2009; LatestRevisionNote: IPC-7351 Footprint Added.; PackageReference: J1-0603; Publisher: Altium Limited; PackageDescription: Chip Resistor; mfr PN: *; Supplier: Digi-Key; Price: .00266
R38 R47 R58 R69 R83 R92 = Res3: Resistor; Manufacturer: Panasonic  Co; Mfr.PN#: ERJ-P14F4533U; Value: 175k/ .5 W 1%; Suppl.PN#: P16125TR-ND; Published: 8-Jun-2000; LatestRevisionDate: 29-May-2009; LatestRevisionNote: IPC-7351 Footprint Added.; PackageReference: J1-0603; Publisher: Altium Limited; PackageDescription: Chip Resistor; mfr PN: *; Package Reference: 1206; Supplier: Digi-Key; SMD: 1210; Price: .055
R39 R48 R59 R70 R84 R93 = Res3: Resistor; Manufacturer: Panasonic Co; Mfr.PN#: ERJ-14NF-4532U; Value: 100k /.5 W 1%; Suppl.PN#: P45.3KAATR-ND; Published: 8-Jun-2000; LatestRevisionDate: 29-May-2009; LatestRevisionNote: IPC-7351 Footprint Added.; PackageReference: J1-0603; Publisher: Altium Limited; PackageDescription: Chip Resistor; mfr PN: *; Package Reference: 1206; Supplier: Digi-key; SMD: 1210; Price: .035
R40 R50 R62 R74 R86 R95 = Res3: Resistor; Manufacturer: Panasonic Co; Mfr.PN#: ERJ-P06F6650V; Value: 3 .125W 1%; Suppl.PN#: P16076TR-ND; Published: 8-Jun-2000; LatestRevisionDate: 29-May-2009; LatestRevisionNote: IPC-7351 Footprint Added.; PackageReference: J1-0603; Publisher: Altium Limited; PackageDescription: Chip Resistor; Supplier: Digi-Key; SMD: 0805; Price: .02
R41 R52 = Res3: Resistor; Manufacturer: Stackpole Electronics; Mfr.PN#: RMCF0805FT1M00; Value: 1K 1%; Suppl.PN#: RMCF0805FT1M00TR-ND; Published: 8-Jun-2000; LatestRevisionDate: 29-May-2009; LatestRevisionNote: IPC-7351 Footprint Added.; PackageReference: J1-0603; Publisher: Altium Limited; PackageDescription: Chip Resistor; manufacture P/N: *; Supplier: Digi-Key; Price: .0027
R42 R51 R60 R67 R77 R85 = Res3: Resistor; Manufacrturer: Vishay Dale; Mfr.PN#: CRCW080545R0FKTA; Value: 45/.125/1%; Suppl.PN#: CRCW080545R0FKTA-ND; Published: 8-Jun-2000; LatestRevisionDate: 29-May-2009; LatestRevisionNote: IPC-7351 Footprint Added.; PackageReference: J1-0603; Publisher: Altium Limited; PackageDescription: Chip Resistor; mfr PN: *; Supplier: Digi-Key
R45 R53 R63 R71 R79 R87 = Res3: Resistor; Manufacturer: Stackpole electronics; Mfr.PN#: RMCF0805FT470R; Value: 470/.125W/1%; Suppl.PN#: RMCF0805FT470RtR-ND; Published: 8-Jun-2000; LatestRevisionDate: 29-May-2009; LatestRevisionNote: IPC-7351 Footprint Added.; PackageReference: J1-0603; Publisher: Altium Limited; PackageDescription: Chip Resistor; Supplier: Digi-Key; Price: .003
R49#1 R49#2 R64 R75 R82 R89 = Res3: Resistor; Manufacturer: Stackpole Electronics; Mfr.PN#: RMCF0805FT2K00; Value: 2K/.125W/1%; Suppl.PN#: RMCF0805FT2K00-ND; Published: 8-Jun-2000; LatestRevisionDate: 29-May-2009; LatestRevisionNote: IPC-7351 Footprint Added.; PackageReference: J1-0603; Publisher: Altium Limited; PackageDescription: Chip Resistor; Supplier: Digi-Key; Price: .033
R61 = Res3: Resistor; Value: 10k/.125W/1%; Published: 8-Jun-2000; LatestRevisionDate: 29-May-2009; LatestRevisionNote: IPC-7351 Footprint Added.; PackageReference: J1-0603; Publisher: Altium Limited; PackageDescription: Chip Resistor
TP9-TP13 = TESTPOINT: TESTPOINT SCOPE GRABBER; Manufacturer Part Number: 5010; Manufacturer: Keystone Electronics; Reel: TH; Supplier 1: Digi-Key; Supplier Part Number 1: 5010K-ND
U5 U9 U14 = STPM34: Manufacturer: STMicroelectronic; Mfr.PN#: STPM34TR; Suppl.PN#: 497-14670-1-ND; Supplier: Digi-Key; Price: 1.16
U6 = PIC32MX534F064F: Manufacturer: Microchip; Mfr.PN#: PIC32MX795F512H-80I/PT; Suppl.PN#: 1778989; Supplier: Farnel; Price: 5.16
U7 U8 U10 U11 U13 U15 = Optoisolator2: 5 Pin Mini Flat Pack Optocoupler; Manufacturer: Avago Technologies; Mfr.PN#: 4N25-300E; Suppl.PN#: 4N25-300; Published: 24-Mar-1999; LatestRevisionDate: 04-Mar-2005; LatestRevisionNote: PCB Footprint replaced, Sch pins re-numbered.; DatasheetVersion: Apr-2004; PackageReference: SOP5(6); Publisher: Altium Limited; PackageDescription: Small Outline; 6 Leads (1 Absent); Body Width 4.4 mm; Pitch 1.27 mm; Supplier: Arrow; Price: .1273
Y2 = XTAL: Crystal Oscillator; Manufacturer: Abracon; Mfr.PN#: ABLS-8.000MHZB4-T; Suppl.PN#: 53-10212-2-ND; Published: 8-Jun-2000; LatestRevisionDate: 17-Jul-2002; LatestRevisionNote: Re-released for DXP Platform.; PackageReference: R38; Publisher: Altium Limited; PackageDescription: Crystal, Thru-Hole; 2 Leads; Body 3.1 x 8.2 mm (Dia.xH); Supplier: Digi-Key; Price: .137
Y3 = XTAL: Crystal Oscillator; Manufacturer: Abracon; Mfr.PN#: ABLS3-16.000MHz-D4Y-T; Suppl.PN#: 535-10852-2-ND; Published: 8-Jun-2000; LatestRevisionDate: 17-Jul-2002; LatestRevisionNote: Re-released for DXP Platform.; PackageReference: R38; Publisher: Altium Limited; PackageDescription: Crystal, Thru-Hole; 2 Leads; Body 3.1 x 8.2 mm (Dia.xH); Supplier: Digi-Key; Price: .288